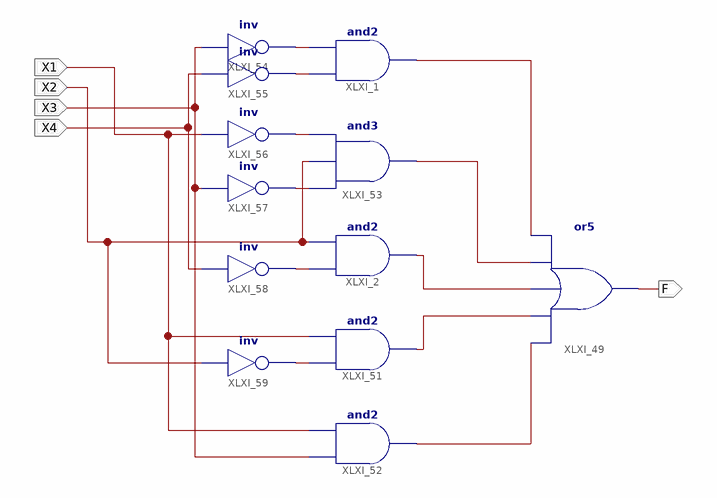
[diagram p0: schematic sheet 1]
// Xilinx ISE schematic bin7seg_f.sch (spartan3e) as structural Verilog: 12 symbols, 5 ports
module bin7seg_f (
  input  X1,
  input  X2,
  input  X3,
  input  X4,
  output F
);

  wire XLXN_1, XLXN_2, XLXN_3, XLXN_9, XLXN_55, XLXN_56, XLXN_57, XLXN_58, XLXN_59, XLXN_60, XLXN_61;

  and XLXI_1 (XLXN_1, XLXN_57, XLXN_56);
  and XLXI_2 (XLXN_3, XLXN_60, X2);
  or XLXI_49 (F, XLXN_55, XLXN_9, XLXN_3, XLXN_2, XLXN_1);
  and XLXI_51 (XLXN_9, XLXN_61, X1);
  and XLXI_52 (XLXN_55, X3, X1);
  and XLXI_53 (XLXN_2, XLXN_59, X2, XLXN_58);
  not XLXI_54 (XLXN_56, X3);
  not XLXI_55 (XLXN_57, X4);
  not XLXI_56 (XLXN_58, X1);
  not XLXI_57 (XLXN_59, X3);
  not XLXI_58 (XLXN_60, X4);
  not XLXI_59 (XLXN_61, X2);
endmodule
